# EAGLE design BrimEff (EAGLE 9.5.2)
CNAME: BrimEffect; CREVISION: 01

## Sheet 1 of 3
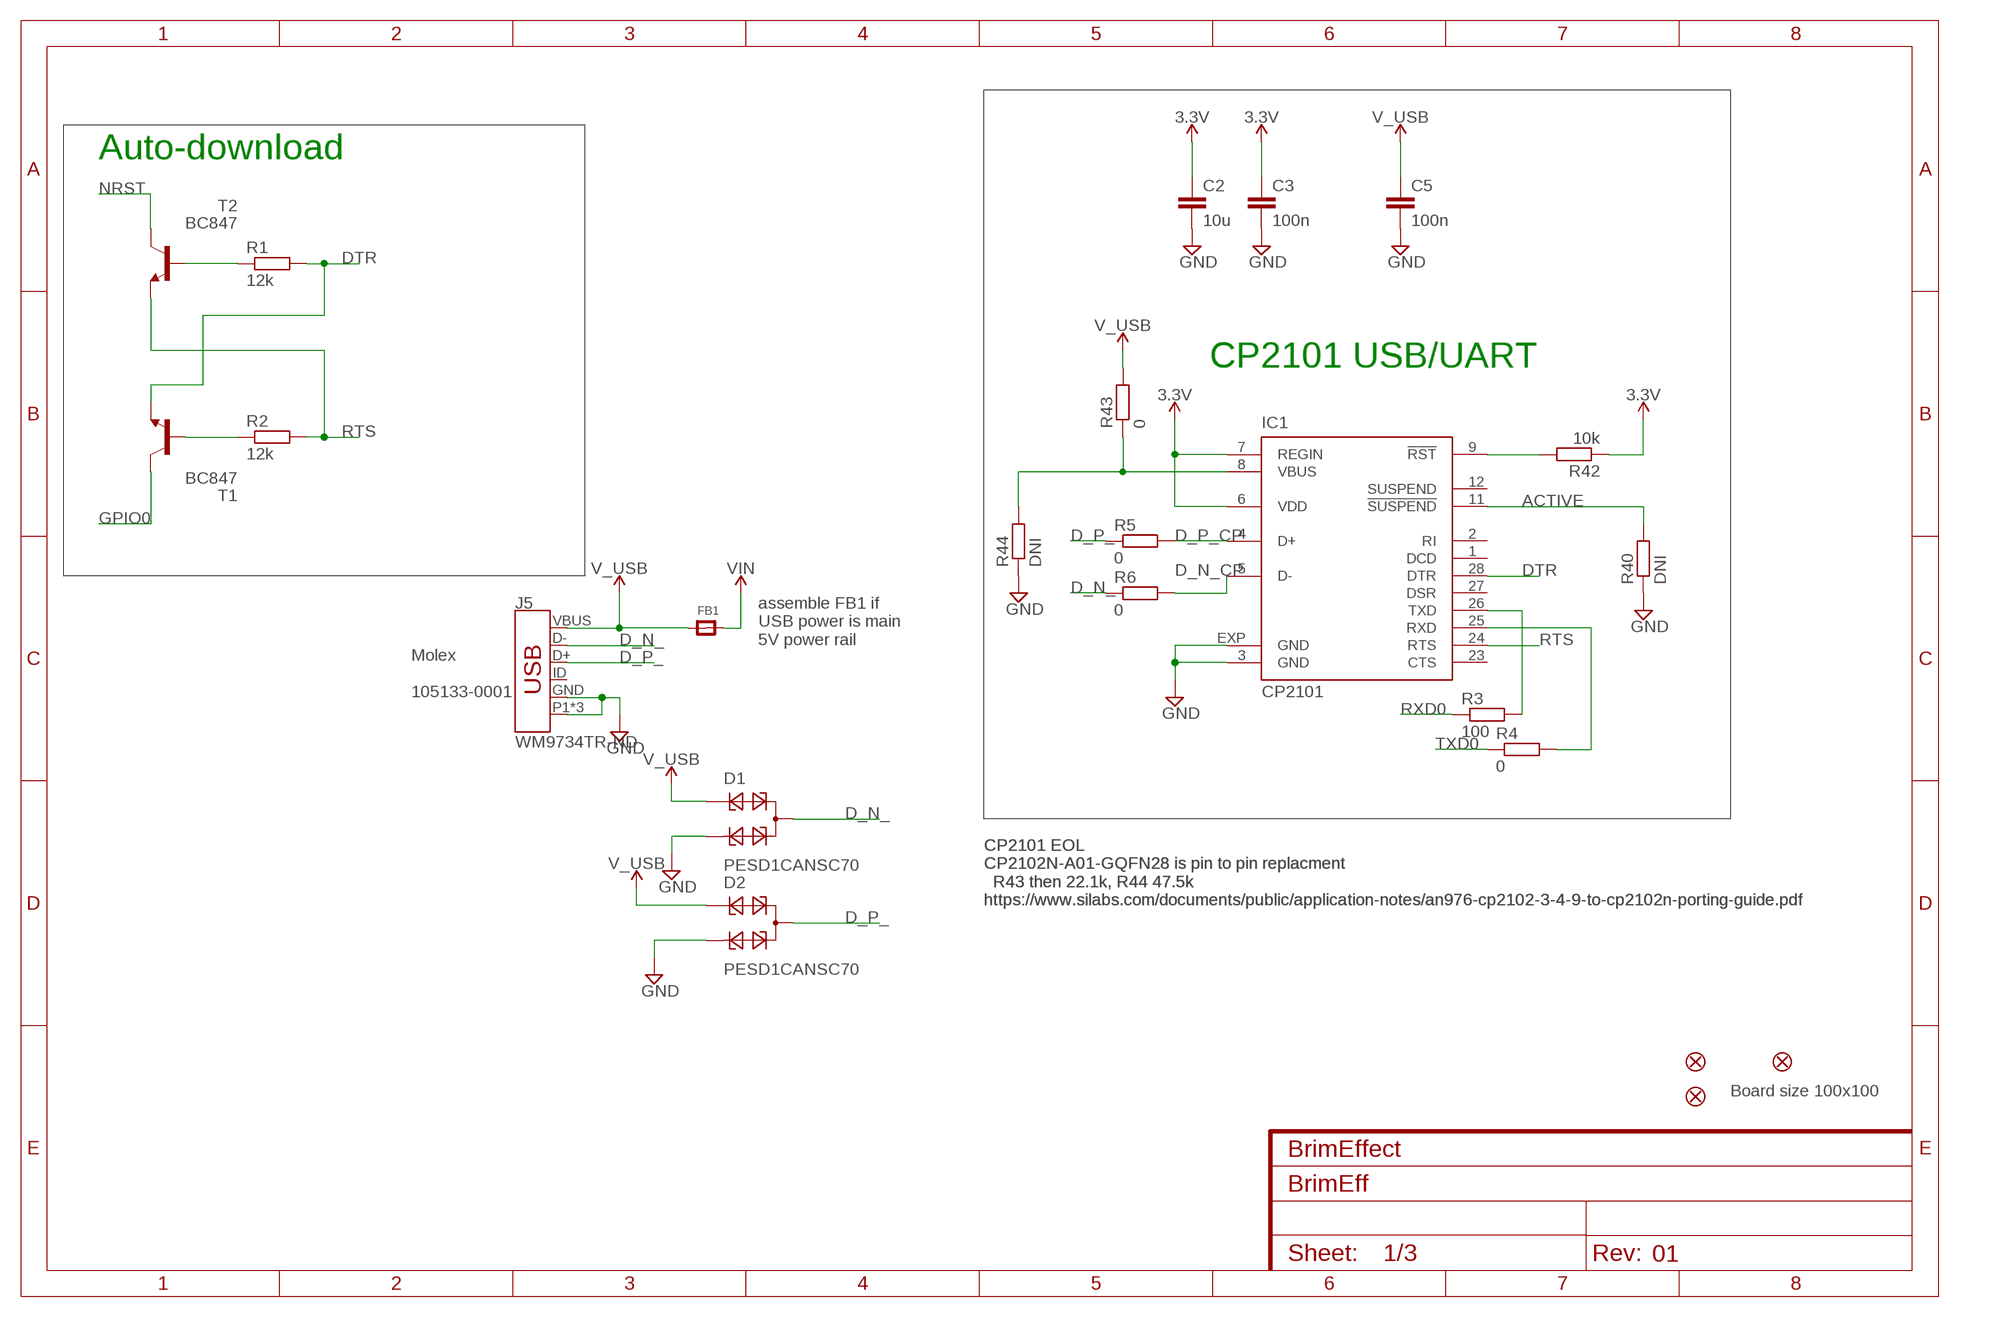
[diagram p0: schematic, sheet 1]

### Parts
C2  10u  C-EUC0603K  [C0603K]
C3  100n  C-EUC0603K  [C0603K]
C5  100n  C-EUC0603K  [C0603K]
D1  PESD1CANSC70  [SOT323-R]
D2  PESD1CANSC70  [SOT323-R]
FB1  FERRITE  [0603]
FID1  FIDUCIAL""  [FIDUCIAL_1MM]
FID2  FIDUCIAL""  [FIDUCIAL_1MM]
FID4  FIDUCIAL""  [FIDUCIAL_1MM]
IC1  CP2101  CP210X_USB_UART  [MLP28]
J5  WM9734TR-ND  USB_MICRO-B_FEMALE-SMT-VERT  [USB-B-MICRO-SMD_VERT]
R1  12k  R-EU_R0603  [R0603]
R2  12k  R-EU_R0603  [R0603]
R3  100  R-EU_R0603  [R0603]
R4  0  R-EU_R0603  [R0603]
R5  0  R-EU_R0603  [R0603]
R6  0  R-EU_R0603  [R0603]
R40  DNI  R-EU_R0603  [R0603]
R42  10k  R-EU_R0603  [R0603]
R43  0  R-EU_R0603  [R0603]
R44  DNI  R-EU_R0603  [R0603]
T1  BC847  [SOT23]
T2  BC847  [SOT23]

### Nets
3.3V: C2.1 C3.1 IC1.6(VDD) IC1.7(REGIN) R42.1 ; also sheet 2,3
ACTIVE: IC1.11(!SUSPEND) R40.2
D_N_: D1.3 J5.D- R6.1
D_N_CP: IC1.5(D-) R6.2
D_P_: D2.3 J5.D+ R5.1
D_P_CP: IC1.4(D+) R5.2
DTR: IC1.28(DTR) R1.2 T1.2(E)
GND: C2.2 C3.2 C5.2 D1.2 D2.2 IC1.3(GND) IC1.EXP(GND) J5.GND J5.P1(SHIELD) J5.P2(SHIELD) J5.P3(SHIELD) R40.1 R44.1 ; also sheet 2,3
GPIO0: T1.3(C) ; also sheet 3
N$1: R1.1 T2.1(B)
N$2: R2.1 T1.1(B)
N$38: IC1.9(!RST) R42.2
N$39: IC1.8(VBUS) R43.1 R44.2
NRST: T2.3(C) ; also sheet 3
RTS: IC1.24(RTS) R2.2 T2.2(E)
RXD0: R3.1 ; also sheet 3
RXD0_CP2101IN: IC1.26(TXD) R3.2
TXD0: R4.1 ; also sheet 3
TXD0_CP2101: IC1.25(RXD) R4.2
V_USB: C5.1 D1.1 D2.1 FB1.1 J5.VBUS R43.2
VIN: FB1.2 ; also sheet 2,3
Unconnected: IC1.1(DCD) IC1.2(RI) IC1.12(SUSPEND) IC1.23(CTS) IC1.27(DSR) J5.ID

### Notes on the sheet
- Auto-download
- CP2101 USB/UART
- assemble FB1 if
  USB power is main
  5V power rail
- Molex
  
  105133-0001
- CP2101 EOL
  CP2102N-A01-GQFN28 is pin to pin replacment
    R43 then 22.1k, R44 47.5k
  https://www.silabs.com/documents/public/application-notes/an976-cp2102-3-4-9-to-cp2102n-porting-guide.pdf
- CP2101 EOL
  CP2102N-A01-GQFN28 is pin to pin replacment
    R43 then 22.1k, R44 47.5k
  https://www.silabs.com/documents/public/application-notes/an976-cp2102-3-4-9-to-cp2102n-porting-guide.pdf
- Board size 100x100

## Sheet 2 of 3
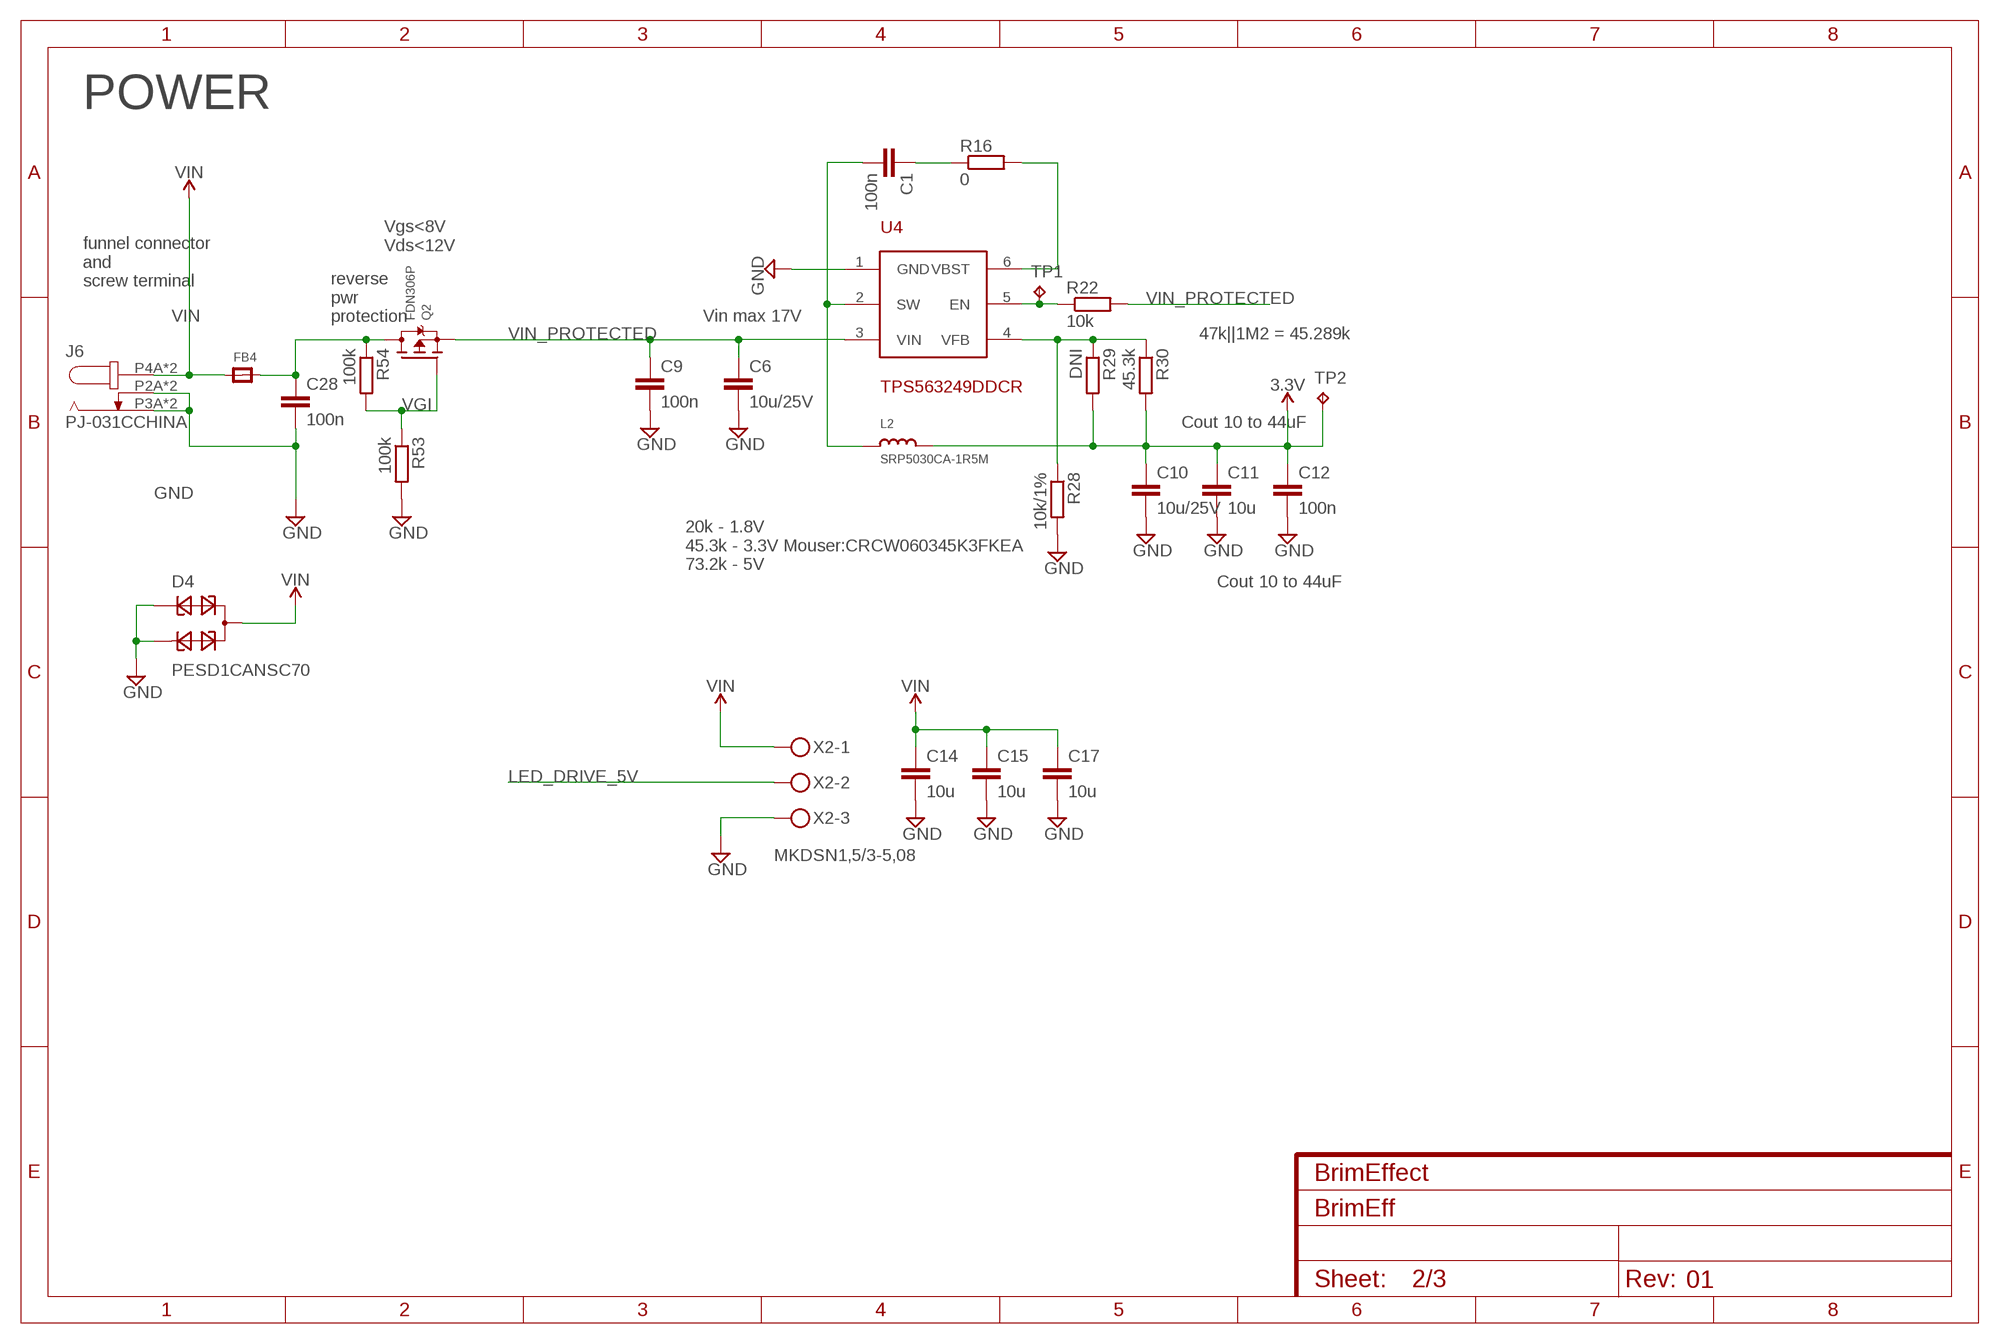
[diagram p1: schematic, sheet 2]

### Parts
C1  100n  C-EUC0603K  [C0603K]
C6  10u/25V  C-EUC0603K  [C0603K]
C9  100n  C-EUC0603K  [C0603K]
C10  10u/25V  C-EUC0603K  [C0603K]
C11  10u  C-EUC0603K  [C0603K]
C12  100n  C-EUC0603K  [C0603K]
C14  10u  C-EUC0603K  [C0603K]
C15  10u  C-EUC0603K  [C0603K]
C17  10u  C-EUC0603K  [C0603K]
C28  100n  C-EUC0603K  [C0603K]
D4  PESD1CANSC70  [SOT323-R]
FB4  FERRITE  [0603]
J6  PJ-031CCHINA  [DC-005_5.5X2.1MM_JACK]
L2  SRP5030CA-1R5M  [SRP5030CA]
Q2  FDN306P  MOSFET-PWIDE  [SOT23-WIDE]
R16  0  R-EU_R0603  [R0603]
R22  10k  R-EU_R0603  [R0603]
R28  10k/1%  R-EU_R0603  [R0603]
R29  DNI  R-EU_R0603  [R0603]
R30  45.3k  R-EU_R0603  [R0603]
R53  100k  R-EU_R0603  [R0603]
R54  100k  R-EU_R0603  [R0603]
TP1  TPTP10R  [TP10R]
TP2  TPTP10R  [TP10R]
U4  TPS563249DDCR  TPS5632149DDCR  [SOT23-6]
X2  MKDSN1,5/3-5,08  [MKDSN1,5/3-5,08]

### Nets
3.3V: C10.1 C11.1 C12.1 L2.P$2 R29.2 R30.2 TP2.TP ; also sheet 1,3
GND: C6.2 C9.2 C10.2 C11.2 C12.2 C14.2 C15.2 C17.2 C28.2 D4.1 D4.2 J6.P2A J6.P2B J6.P3A J6.P3B R28.2 R53.2 U4.1(GND) X2.3 ; also sheet 1,3
LED_DRIVE_5V: X2.2 ; also sheet 3
N$3: C1.1 R16.1
N$4: C28.1 FB4.2 Q2.3(D) R54.1
N$15: R16.2 U4.6(VBST)
N$19: C1.2 L2.P$1 U4.2(SW)
N$23: R22.1 TP1.TP U4.5(EN)
N$24: R28.1 R29.1 R30.1 U4.4(VFB)
VGI: Q2.1(G) R53.1 R54.2
VIN: C14.1 C15.1 C17.1 D4.3 FB4.1 J6.P4A J6.P4B X2.1 ; also sheet 1,3
VIN_PROTECTED: C6.1 C9.1 Q2.2(S) R22.2 U4.3(VIN) ; also sheet 3

### Notes on the sheet
- POWER
- Vgs<8V
  Vds<12V
- funnel connector
  and
  screw terminal
- reverse
  pwr
  protection
- Vin max 17V
- 47k||1M2 = 45.289k
- Cout 10 to 44uF
- 20k - 1.8V
  45.3k - 3.3V Mouser:CRCW060345K3FKEA
  73.2k - 5V
- Cout 10 to 44uF

## Sheet 3 of 3
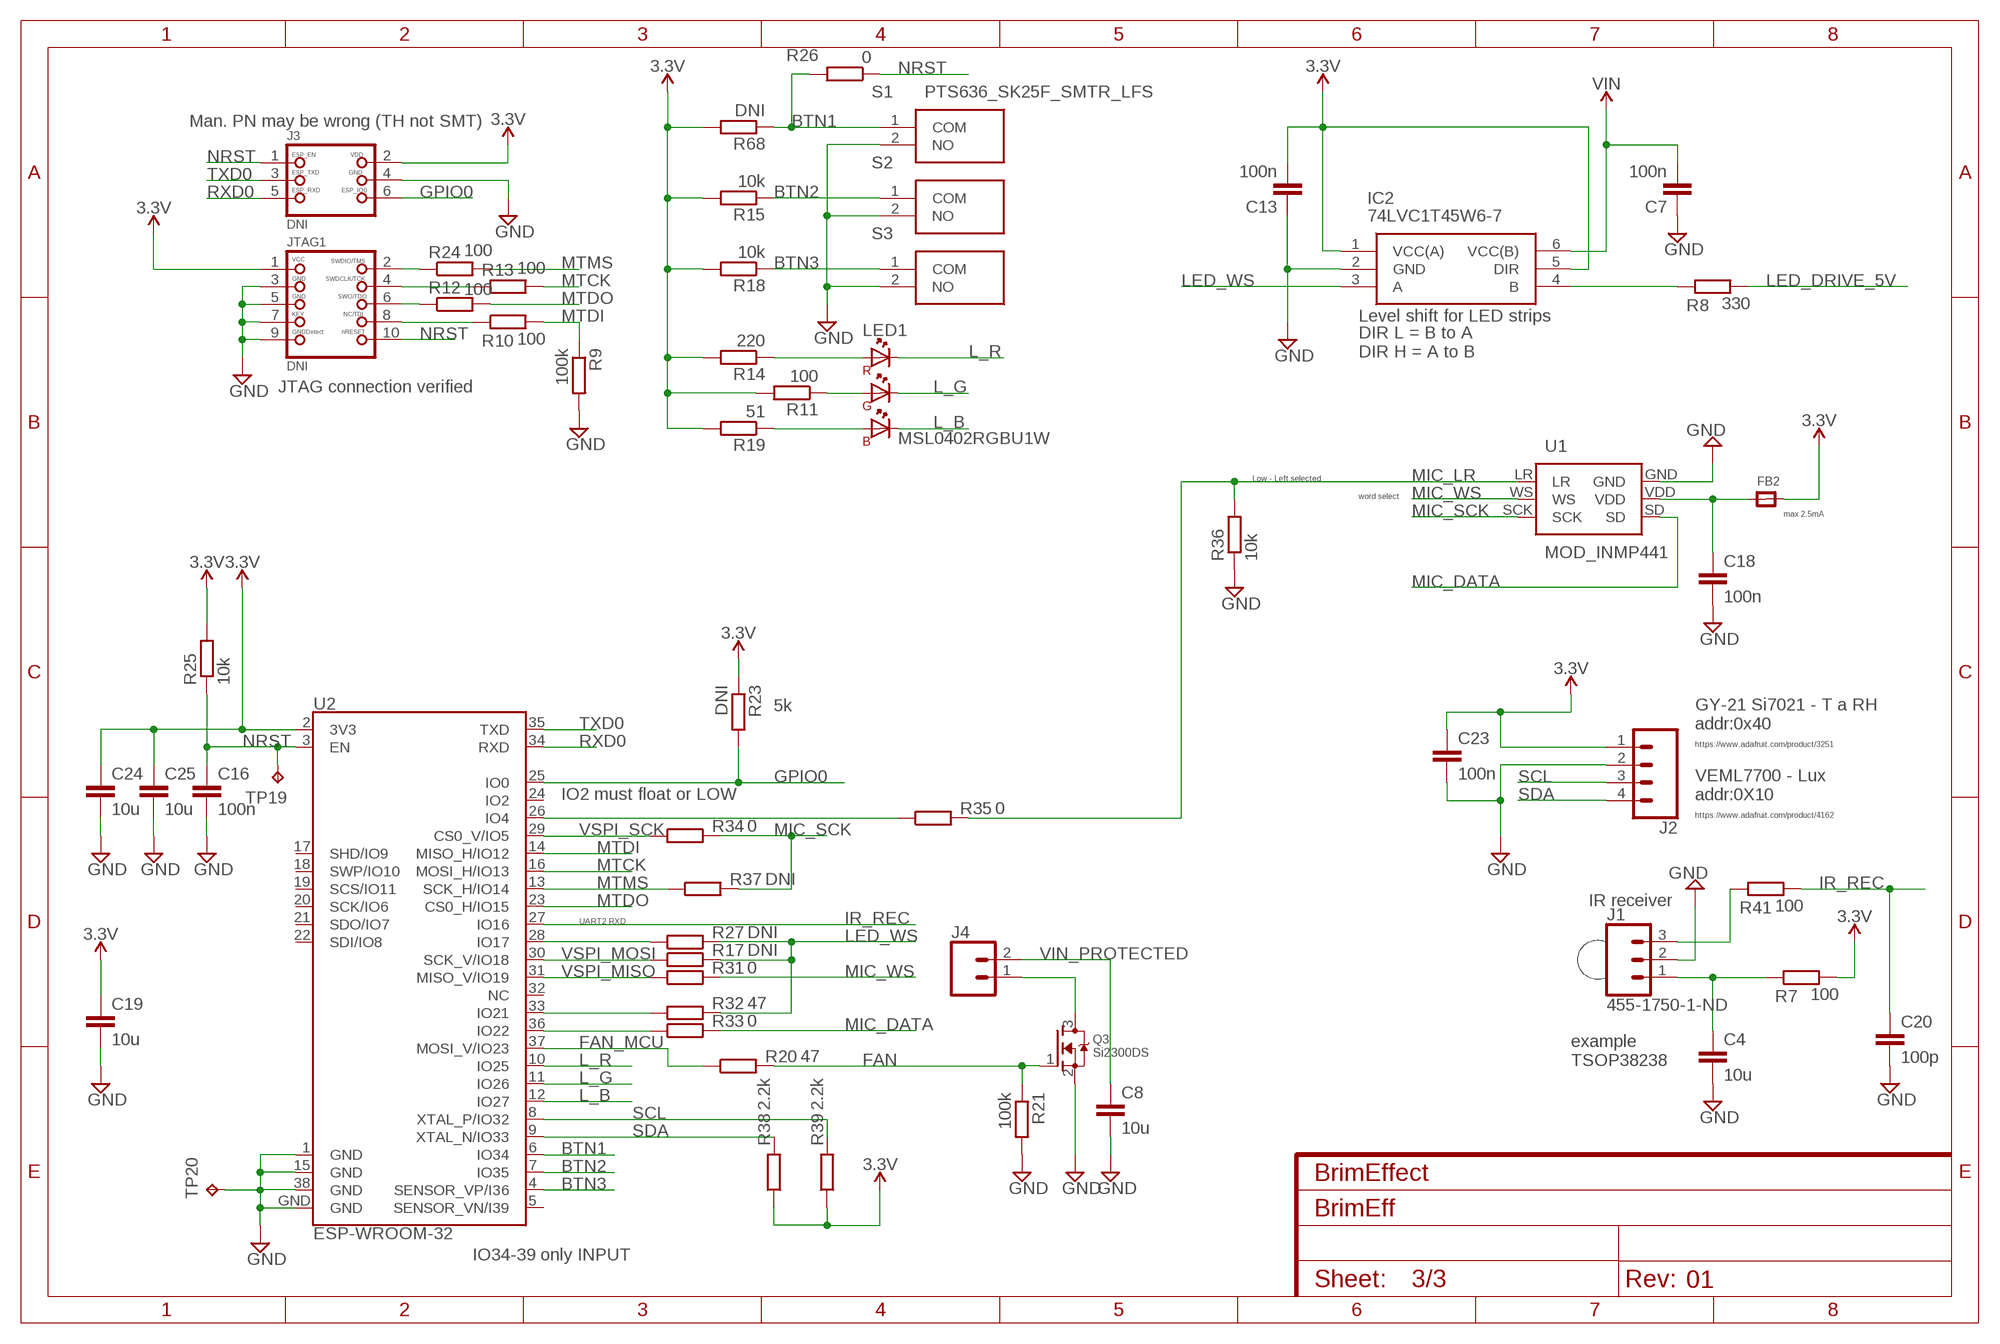
[diagram p2: schematic, sheet 3]

### Parts
C4  10u  C-EUC0603K  [C0603K]
C7  100n  C-EUC0603K  [C0603K]
C8  10u  C-EUC0603K  [C0603K]
C13  100n  C-EUC0603K  [C0603K]
C16  100n  C-EUC0603K  [C0603K]
C18  100n  C-EUC0603K  [C0603K]
C19  10u  C-EUC0603K  [C0603K]
C20  100p  C-EUC0603K  [C0603K]
C23  100n  C-EUC0603K  [C0603K]
C24  10u  C-EUC0603K  [C0603K]
C25  10u  C-EUC0603K  [C0603K]
FB2  FERRITE  [0603]
IC2  74LVC1T45W6-7  [SOT95P285X140-6N]
J1  455-1750-1-ND  CONN_03  [1X03]
J2  CONN_04PTH  [1X04]
J3  DNI  HEADER_3X6P_ESPPROG  [2X03_1.27MM_SMT]
J4  CONN_02  [1X02]
JTAG1  DNI  JTAG-CORTEXM3  [2X05_1.27MM_SMT]
LED1  MSL0402RGBU1W  [MSL0402RGBU1-W]
Q3  Si2300DS  MOSFET-NREFLOW  [SOT23]
R7  100  R-EU_R0603  [R0603]
R8  330  R-EU_R0603  [R0603]
R9  100k  R-EU_R0603  [R0603]
R10  100  R-EU_R0603  [R0603]
R11  100  R-EU_R0603  [R0603]
R12  100  R-EU_R0603  [R0603]
R13  100  R-EU_R0603  [R0603]
R14  220  R-EU_R0603  [R0603]
R15  10k  R-EU_R0603  [R0603]
R17  DNI  R-EU_R0603  [R0603]
R18  10k  R-EU_R0603  [R0603]
R19  51  R-EU_R0603  [R0603]
R20  47  R-EU_R0603  [R0603]
R21  100k  R-EU_R0603  [R0603]
R23  DNI  R-EU_R0603  [R0603]
R24  100  R-EU_R0603  [R0603]
R25  10k  R-EU_R0603  [R0603]
R26  0  R-EU_R0603  [R0603]
R27  DNI  R-EU_R0603  [R0603]
R31  0  R-EU_R0603  [R0603]
R32  47  R-EU_R0603  [R0603]
R33  0  R-EU_R0603  [R0603]
R34  0  R-EU_R0603  [R0603]
R35  0  R-EU_R0603  [R0603]
R36  10k  R-EU_R0603  [R0603]
R37  DNI  R-EU_R0603  [R0603]
R38  2.2k  R-EU_R0603  [R0603]
R39  2.2k  R-EU_R0603  [R0603]
R41  100  R-EU_R0603  [R0603]
R68  DNI  R-EU_R0603  [R0603]
S1  PTS636_SK25F_SMTR_LFS  [PTS636SK25FSMTRLFS]
S2  PTS636_SK25F_SMTR_LFS  [PTS636SK25FSMTRLFS]
S3  PTS636_SK25F_SMTR_LFS  [PTS636SK25FSMTRLFS]
TP19  TPTP10R  [TP10R]
TP20  TPTP10R  [TP10R]
U1  MOD_INMP441  [MOD_INMP441]
U2  ESP-WROOM-32  [ESP-WROOM-32]

### Nets
3.3V: C13.2 C19.1 C23.1 C24.1 C25.1 FB2.2 IC2.1(VCC(A)) IC2.5(DIR) J2.1 J3.2 JTAG1.1 R7.2 R11.2 R14.2 R15.2 R18.2 R19.2 R23.1 R25.2 R38.1 R39.1 R68.2 U2.2(3V3) ; also sheet 1,2
BTN1: R26.2 R68.1 S1.1(COM) U2.6(IO34)
BTN2: R15.1 S2.1(COM) U2.7(IO35)
BTN3: R18.1 S3.1(COM) U2.4(SENSOR_VP/I36)
FAN: Q3.1(G) R20.2 R21.1
FAN_MCU: R20.1 U2.37(MOSI_V/IO23)
GND: C4.2 C7.1 C8.2 C13.1 C16.2 C18.2 C19.2 C20.2 C23.2 C24.2 C25.2 IC2.2(GND) J1.2 J2.2 J3.4 JTAG1.3 JTAG1.5 JTAG1.7 JTAG1.9 Q3.2(S) R9.2 R21.2 R36.1 S1.2(NO) S2.2(NO) S3.2(NO) TP20.TP U1.GND U2.1(GND) U2.15(GND) U2.38(GND) U2.GND ; also sheet 1,2
GPIO0: J3.6 R23.2 U2.25(IO0) ; also sheet 1
IR_REC: C20.1 R41.2 U2.27(IO16)
L_B: LED1.1(K_B) U2.12(IO27)
L_G: LED1.2(K_G) U2.11(IO26)
L_R: LED1.3(K_R) U2.10(IO25)
LED_DRIVE_5V: R8.2 ; also sheet 2
LED_WS: IC2.3(A) R17.2 R27.2 R32.2
MIC_DATA: R33.2 U1.SD
MIC_LR: R35.2 R36.2 U1.LR
MIC_SCK: R34.2 R37.2 U1.SCK
MIC_WS: R31.2 U1.WS
MTCK: R13.2 U2.16(MOSI_H/IO13)
MTDI: R9.1 R10.2 U2.14(MISO_H/IO12)
MTDO: R12.2 U2.23(CS0_H/IO15)
MTMS: R24.2 R37.1 U2.13(SCK_H/IO14)
N$5: J1.3 R41.1
N$6: LED1.6(A_B) R19.1
N$8: J4.1 Q3.3(D)
N$9: C4.1 J1.1 R7.1
N$10: IC2.4(B) R8.1
N$11: LED1.5(A_G) R11.1
N$12: C18.1 FB2.1 U1.VDD
N$13: R27.1 U2.28(IO17)
N$14: R32.1 U2.33(IO21)
N$16: LED1.4(A_R) R14.1
N$17: R33.1 U2.36(IO22)
N$20: R35.1 U2.26(IO4)
NRST: C16.1 J3.1 JTAG1.10 R25.1 R26.1 TP19.TP U2.3(EN) ; also sheet 1
RXD0: J3.5 U2.34(RXD) ; also sheet 1
SCL: J2.3 R39.2 U2.8(XTAL_P/IO32)
SDA: J2.4 R38.2 U2.9(XTAL_N/IO33)
TCKCONN: JTAG1.4 R13.1
TDICONN: JTAG1.8 R10.1
TDOCONN: JTAG1.6 R12.1
TMSCONN: JTAG1.2 R24.1
TXD0: J3.3 U2.35(TXD) ; also sheet 1
VIN: C7.2 IC2.6(VCC(B)) ; also sheet 1,2
VIN_PROTECTED: C8.1 J4.2 ; also sheet 2
VSPI_MISO: R31.1 U2.31(MISO_V/IO19)
VSPI_MOSI: R17.1 U2.30(SCK_V/IO18)
VSPI_SCK: R34.1 U2.29(CS0_V/IO5)
Unconnected: U2.5(SENSOR_VN/I39) U2.17(SHD/IO9) U2.18(SWP/IO10) U2.19(SCS/IO11) U2.20(SCK/IO6) U2.21(SDO/IO7) U2.22(SDI/IO8) U2.24(IO2) U2.32(NC)

### Notes on the sheet
- Man. PN may be wrong (TH not SMT)
- Level shift for LED strips
- DIR L = B to A
  DIR H = A to B
- JTAG connection verified
- Low - Left selected
- word select
- max 2.5mA
- 5k
- GY-21 Si7021 - T a RH 
  addr:0x40
- https://www.adafruit.com/product/3251
- IO2 must float or LOW
- VEML7700 - Lux
  addr:0X10
- https://www.adafruit.com/product/4162
- IR receiver
- UART2 RXD
- example
  TSOP38238
- IO34-39 only INPUT

## Library data of the parts
C1 C3 C5 C7 C9 C12 C13 C16 C18 C23 C28 = resistor:C-EU: CAPACITOR, European symbol; PARTNO: CC0603KRX7R8BB104
C2 C4 C8 C11 C14 C15 C17 C19 C20 C24 C25 = resistor:C-EU: CAPACITOR, European symbol; PARTNO: GRM188R61A106KE69J
C6 C10 = resistor:C-EU: CAPACITOR, European symbol; PARTNO: GRM188R61E106KA73J
D1 D2 D4 = diode:PESD1CAN: CAN bus ESD protection diode Source: http://www.nxp.com/documents/data_sheet/PESD1CAN.pdf; PARTNO: PESD1CAN-UX
FB1 FB2 FB4 = microbuilder:FERRITE: Ferrite Bead 0603 MMZ1608B121C - 120 Ohm @ 100MHz, 600mA, 0.15 Ohm DC Resistance - Digikey: 445-2164-1-ND BK1608HW121-T - 120 Ohm, 600mA Ferrite Chip - Digikey: 587-1876-2-ND 0805 HZ0805B272R-10 - 2.7K Ohm @ 100MHz, 200mA, 0.8 Ohm DC Resistance - Digikey: 240-2504-1-ND (see also Murata BLM21BD272SN1L) MMZ2012Y152B - 1.5K Ohm @ 100MHz, 500mA, 0.4 Ohm DC Resistance - Digikey: 445-1560-1-ND - Mainly for high frequency (80-400MHz) MMZ2012R102A - 1K Ohm @ 100MHz, 500mA, 0.3 Ohm DC Resistance - Digikey: 445-1555-2-ND - More general purpose (10-200MHz); PARTNO: BLM18PG121SN1D
FID1 FID2 FID4 = microbuilder:FIDUCIAL: Fiducial Alignment Points Various fiducial points for machine vision alignment.
IC1 = SparkFun-Retired:CP210X_USB_UART: Single-Chip USB to UART Bridge Source: www.silabs.com .. CP2101.pdf / cp2102.pdf. Spark Fun Electronics SKU : COM-00310 RETIRED: IC-00865; PARTNO: CP2101-GM; PROD_ID: COM-00310
IC2 = SamacSys_Parts:74LVC1T45W6-7: Translation - Voltage Levels Logic LVC 1G Translator Source: Datasheet <https://componentsearchengine.com/Datasheets/1/74LVC1T45W6-7.pdf>; DESCRIPTION: Translation - Voltage Levels Logic LVC 1G Translator; HEIGHT: 1.4mm; MANUFACTURER_NAME: Diodes Inc.; MANUFACTURER_PART_NUMBER: 74LVC1T45W6-7; MOUSER_PART_NUMBER: 621-74LVC1T45W6-7; MOUSER_PRICE-STOCK: https://www.mouser.com/Search/Refine.aspx?Keyword=621-74LVC1T45W6-7
J1 = SparkFun-Connectors:CONN_03: Multi connection point. Often used as Generic Header-pin footprint for 0.1 inch spaced/style header connections On any of the 0.1 inch spaced packages, you can populate with these: Break Away Headers - Straight <https://www.sparkfun.com/products/116> (PRT-00116) Break Away Male Headers - Right Angle <https://www.sparkfun.com/products/553> (PRT-00553) Female Headers <https://www.sparkfun.com/products/115> (PRT-00115) Break Away Headers - Machine Pin <https://www.sparkfun.com/products/117> (PRT-00117) Break Away Female Headers - Swiss Machine Pin <https://www.sparkfun.com/products/743> (PRT-00743) Stackable Header - 3 Pin (Female, 0.1") <https://www.sparkfun.com/products/13875> (PRT-13875) For SCREWTERMINALS and SPRING TERMINALS visit here: Screw Terimnals on SparkFun.com <https://www.sparkfun.com/search/results?term=Screw+Terminals> (5mm/3.5mm/2.54mm spacing) This device is also useful as a general connection point to wire up your design to another part of your project. Our various solder wires solder well into these plated through hole pads. Hook-Up Wire - Assortment (Stranded, 22 AWG) <https://www.sparkfun.com/products/11375> (PRT-11375) Hook-Up Wire - Assortment (Solid Core, 22 AWG) <https://www.sparkfun.com/products/11367> (PRT-11367) View the entire wire category on our website here <https://www.sparkfun.com/categories/141> Special notes: Molex polarized connector foot print use with SKU : PRT-08232 with associated crimp pins and housings.; PROD_ID: XXX-00000
J2 = SparkFun-Connectors:CONN_04: Multi connection point. Often used as Generic Header-pin footprint for 0.1 inch spaced/style header connections On any of the 0.1 inch spaced packages, you can populate with these: Break Away Headers - Straight <https://www.sparkfun.com/products/116> (PRT-00116) Break Away Male Headers - Right Angle <https://www.sparkfun.com/products/553> (PRT-00553) Female Headers <https://www.sparkfun.com/products/115> (PRT-00115) Break Away Headers - Machine Pin <https://www.sparkfun.com/products/117> (PRT-00117) Break Away Female Headers - Swiss Machine Pin <https://www.sparkfun.com/products/743> (PRT-00743) For SCREWTERMINALS and SPRING TERMINALS visit here: Screw Terimnals on SparkFun.com <https://www.sparkfun.com/search/results?term=Screw+Terminals> (5mm/3.5mm/2.54mm spacing) This device is also useful as a general connection point to wire up your design to another part of your project. Our various solder wires solder well into these plated through hole pads. Hook-Up Wire - Assortment (Stranded, 22 AWG) <https://www.sparkfun.com/products/11375> (PRT-11375) Hook-Up Wire - Assortment (Solid Core, 22 AWG) <https://www.sparkfun.com/products/11367> (PRT-11367) View the entire wire category on our website here <https://www.sparkfun.com/categories/141> Special notes: Molex polarized connector foot print use with SKU : PRT-08231 with associated crimp pins and housings. 1MM SMD Version SKU: PRT-10208; PROD_ID: CONN-09696
J3 = FRA_eagle_lib:HEADER_3X6P_ESPPROG; PARTNO: HTMS-103-03-T-D-SM
J4 = SparkFun-Connectors:CONN_02: Multi connection point. Often used as Generic Header-pin footprint for 0.1 inch spaced/style header connections On any of the 0.1 inch spaced packages, you can populate with these: Break Away Headers - Straight <https://www.sparkfun.com/products/116> (PRT-00116) Break Away Male Headers - Right Angle <https://www.sparkfun.com/products/553> (PRT-00553) Female Headers <https://www.sparkfun.com/products/115> (PRT-00115) Break Away Headers - Machine Pin <https://www.sparkfun.com/products/117> (PRT-00117) Break Away Female Headers - Swiss Machine Pin <https://www.sparkfun.com/products/743> (PRT-00743) For SCREWTERMINALS and SPRING TERMINALS visit here: Screw Terimnals on SparkFun.com <https://www.sparkfun.com/search/results?term=Screw+Terminals> (5mm/3.5mm/2.54mm spacing) This device is also useful as a general connection point to wire up your design to another part of your project. Our various solder wires solder well into these plated through hole pads. Hook-Up Wire - Assortment (Stranded, 22 AWG) <https://www.sparkfun.com/products/11375> (PRT-11375) Hook-Up Wire - Assortment (Solid Core, 22 AWG) <https://www.sparkfun.com/products/11367> (PRT-11367) View the entire wire category on our website here <https://www.sparkfun.com/categories/141> Special notes: Molex polarized connector foot print use with: PRT-08233 with associated crimp pins and housings. 2.54_SCREWTERM for use with PRT-10571. 3.5mm Screw Terminal footprints for PRT-08084 5mm Screw Terminal footprints for use with PRT-08432
J5 = SparkFun-Connectors:USB_MICRO-B: USB Type Micro-B Connector Male/female and PTH/SMT variants SparkFun Products: SparkFun microB USB Breakout <https://www.sparkfun.com/products/12035> SparkFun USB microB Plug Breakout <https://www.sparkfun.com/products/10031> SparkFun ESP8266 Thing <https://www.sparkfun.com/products/13231>; PARTNO: 105133-0001; PROD_ID: CONN-13534
J6 = SamacSys_Parts:PJ-031C: DC Power Connectors Power Jacks Source: Datasheet <https://componentsearchengine.com/Datasheets/1/PJ-031C.pdf>
JTAG1 = microbuilder:JTAG-CORTEXM3: Serial Wire (SW-DP) Connector This standard 0.05" 10-pin connector is for use with the Cortex M0/M3's native SWD (serial wire debugger) interface (SW-DP). Some boards support a 20-pin combined JTAG+SWD connector (SWJ-DP), such as the LPC1700 family, but many smaller devices only work with SWD which typically use the smaller 10-pin SW-DP connecter (the LPC1300 family, for example, only supports SWD). 2x05 1.27mm/0.05" Connector: This is the standard SMT connector defined by ARM for all Cortex devices, and should be used in most situations and for forward-compatibility since any new devices coming to market will likely use this connector. MOLEX 10 Pin 0.1" Connector: This 0.1" 10 pin connector has the same pin layout as the standard 0.05" connector, but is easier to work with if you are using standard jumper wires or custom cables to connect your SWD hardware. MOLEX 20 Pin 0.1" Connector: This 0.1" 20 pin connector is the same model used for ARM7/ARM9 JTAG debuggers, but is connected to match the pins on the Segger J-Link for ARM (which supports both JTAG and SWD debugging). See the following document from ARM for more information on Cortex M3 Debug Connectors: http://infocenter.arm.com/help/topic/com.arm.doc.faqs/attached/13634/cortex_debug_connectors.pdf And the following page for an overview with images of the different connector types: http://www.keil.com/peripherals/coresight/connectors.asp; PARTNO: M50-3600542R
L2 = FRA_eagle_lib:SRP5030CA-1R5M: https://www.bourns.com/docs/Product-Datasheets/SRP5030CA.pdf https://www.mouser.com/ProductDetail/Bourns/SRP5030CA-1R5M?qs=%2Fha2pyFadui7REpqWHuidBV20ENgXdYStxO18hOBLFz1Bpqagkv5Sg%3D%3D; PARTNO: SRP5030CA-1R5M
LED1 = SamacSys_Parts:MSL0402RGBU1: High Brightness RGB LED SMT 1816(0706) Source: Datasheet <https://componentsearchengine.com/Datasheets/1/MSL0402RGBU1.pdf>
Q2 = microbuilder:MOSFET-P: P-Channel Mosfet LEGEND VDS: Voltage Drain-Source ID: Drain Current RDS(ON): Drain-Source On-State Resistance VGS(TH): Gate-Source Threshold Voltage CISS: Drain-Source Input Capacitance SOT-23 Name VDS ID RDS(ON) VGS(TH) CISS Order Number IRLML5103 30V 760mA 600 mOhm -- 75pF @ 25V Digikey: IRLML5103PBFCT-ND IRLML6401 12V 4.3A 50 mOhm 950mV @ 250µA 830pF @ 10V Digikey: IRLML6401PBFTR-ND NTR0202PL 20V 400mA 800 mOhm 2.3V @ 250uA 70pF @ 5V Digikey: NTR0202PLT1GOSTR-ND NTR4101PT1G 20V 1.8A 85 mOhm 1.2V @ 250uA 675pF @ 10V Digikey: NTR4101PT1GOSCT-ND DMP2004K 20V 600mA 900 mOhm 1V @ 250uA 175pF @ 16V Digikey: DMP2004KDICT-ND PMV65XP 20V 3.9A 76 mOhm 950mV @ 1mA 725pF @ 20V Digikey: 568-2358-2-ND TO-252 Name VDS ID RDS(ON) VGS(TH) CISS Order Number AOD417 30V 25A 34 mOhm 3V @ 250µA 920pF @ 15V Digikey: 785-1106-2-ND; PARTNO: FDN306P
Q3 = adafruit:MOSFET-N: N-Channel Mosfet 2N7002E - 60V 260mA SOT23 [Digikey: 2N7002ET1GOSTR-ND] - REEL BSH103 - 30V 850mA SOT23 [Digikey: 568-5013-1-ND]; PARTNO: SI2300DS-T1-GE3
R1 R2 = resistor:R-EU_: RESISTOR, European symbol; PARTNO: RC0603FR-0712KL
R3 R7 R8 R10-R14 R19 R24 R41 = resistor:R-EU_: RESISTOR, European symbol; PARTNO: CRCW0603100RFKEAC
R4-R6 R16 R23 R40 R43 R44 = resistor:R-EU_: RESISTOR, European symbol; PARTNO: CRCW06030000Z0EAC
R9 R21 R53 R54 = resistor:R-EU_: RESISTOR, European symbol; PARTNO: CRCW0603100KFKEAC
R15 R18 R22 R25 R26 R36 R42 R68 = resistor:R-EU_: RESISTOR, European symbol; PARTNO: CRCW060310K0JNEAC
R17 R20 R27 R31-R35 R37-R39 = resistor:R-EU_: RESISTOR, European symbol; PARTNO: CRCW060347R0FKEAC
R28 = resistor:R-EU_: RESISTOR, European symbol; PARTNO: RN73R1JTTD1002D25
R29 = resistor:R-EU_: RESISTOR, European symbol
R30 = resistor:R-EU_: RESISTOR, European symbol; PARTNO: ERJ-PB3D4532V
S1-S3 = SamacSys_Parts:PTS636_SK25F_SMTR_LFS: Tactile Switches Tact 50mA 12VDC, 6.0x3.5, 2.5mm H, 250gf, F leads, No ground pin, Red Actuator Source: Datasheet <https://componentsearchengine.com/Datasheets/1/PTS636 SK25F SMTR LFS.pdf>; DESCRIPTION: Tactile Switches Tact 50mA 12VDC, 6.0x3.5, 2.5mm H, 250gf, F leads, No ground pin, Red Actuator; HEIGHT: 2.7mm; MANUFACTURER_NAME: C & K COMPONENTS; MANUFACTURER_PART_NUMBER: PTS636 SK25F SMTR LFS; MOUSER_PART_NUMBER: 611-PTS636SK25FSMTRL; MOUSER_PRICE-STOCK: https://www.mouser.com/Search/Refine.aspx?Keyword=611-PTS636SK25FSMTRL
T1 T2 = transistor-neu-to92:BC847: NPN TRANSISTOR; PARTNO: BC847A-TP
TP1 TP2 TP19 TP20 = testpad:TP: Test pad
U1 = Mic_module_INMP441:MOD_INMP441
U2 = SparkFun-RF:ESP-WROOM-32; PARTNO: ESP32-WROOM-32; PROD_ID: IC-13849
U4 = FRA_eagle_lib:TPS5632149DDCR: TPS563249 17-V, 3-A, Constant 1.4-MHz Synchronous Step-Down Voltage Regulator datasheet <http://www.ti.com/lit/ds/symlink/tps563249.pdf> • Input Voltage Range: 4.5 V to 17 V • Output Voltage Range: 0.6 V to 7 V The TPS563249 is a simple, easy-to-use, 3 A synchronous step-down converter in SOT-23 package. The device is optimized to operate with minimum external component counts and also optimized to achieve low standby current. This switching regulator employs D-CAP3 mode control providing a fast transient response and supporting both low-equivalent series resistance (ESR) output capacitors such as specialty polymer and ultra-low ESR ceramic capacitors with no external compensation components. TPS563249 operates in Forced Continuous Conduction Mode (FCCM), which maintains fixed 1.4 MHz switching frequency during light load operation and eliminates system interference. The TPS563249 is available in a 6-pin 1.6-mm × 2.9-mm SOT (DDC) package, and specified from a –40°C to 125°C junction temperature.; PARTNO: TPS563249DDCR
X2 = con-phoenix-508:MKDSN1,5/3-5,08: MKDSN 1,5/ 3-5,08 Printklemme Nennstrom: 13,5 A Nennspannung: 250 V Rastermaß: 5,08 mm Polzahl: 3 Anschlussart: Schraubanschluss Montage: Löten Anschlussrichtung Leiter/Platine: 0 ° Artikelnummer: 1729131 Source: http://eshop.phoenixcontact.com .. 1729131.pdf

## Board
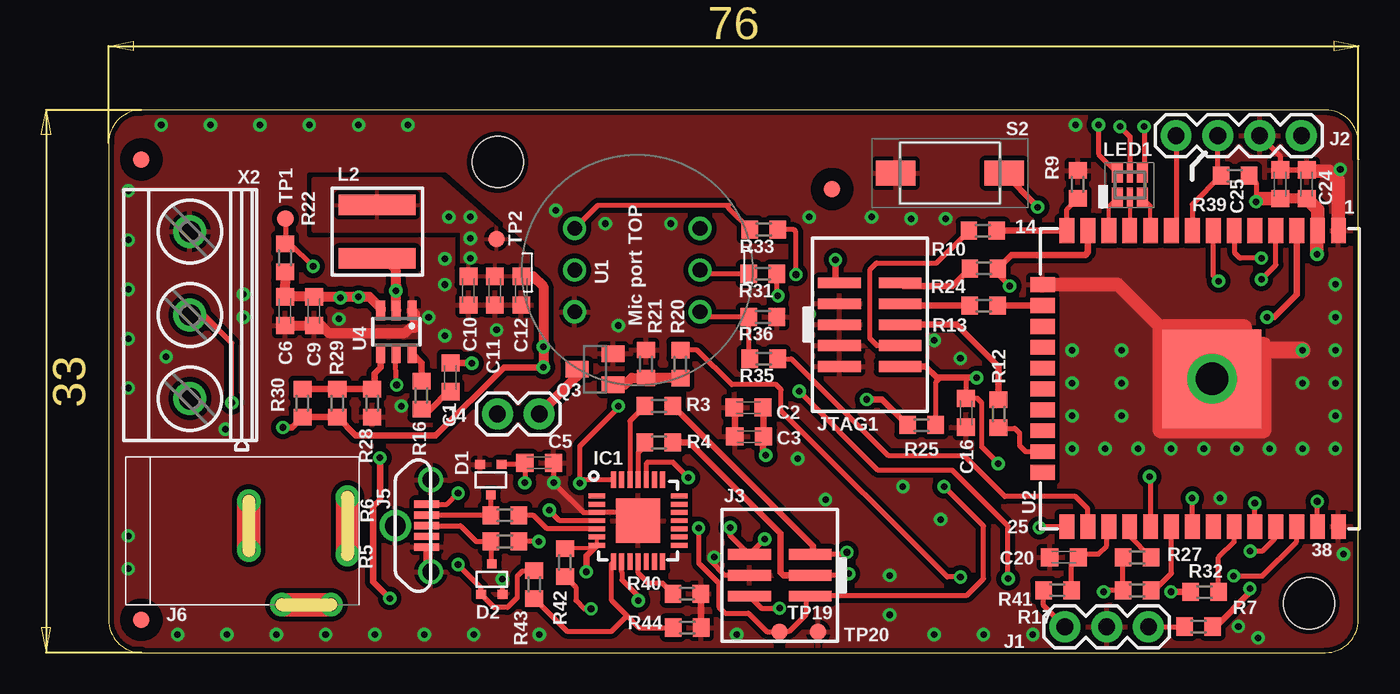
[diagram p3: board, top side]
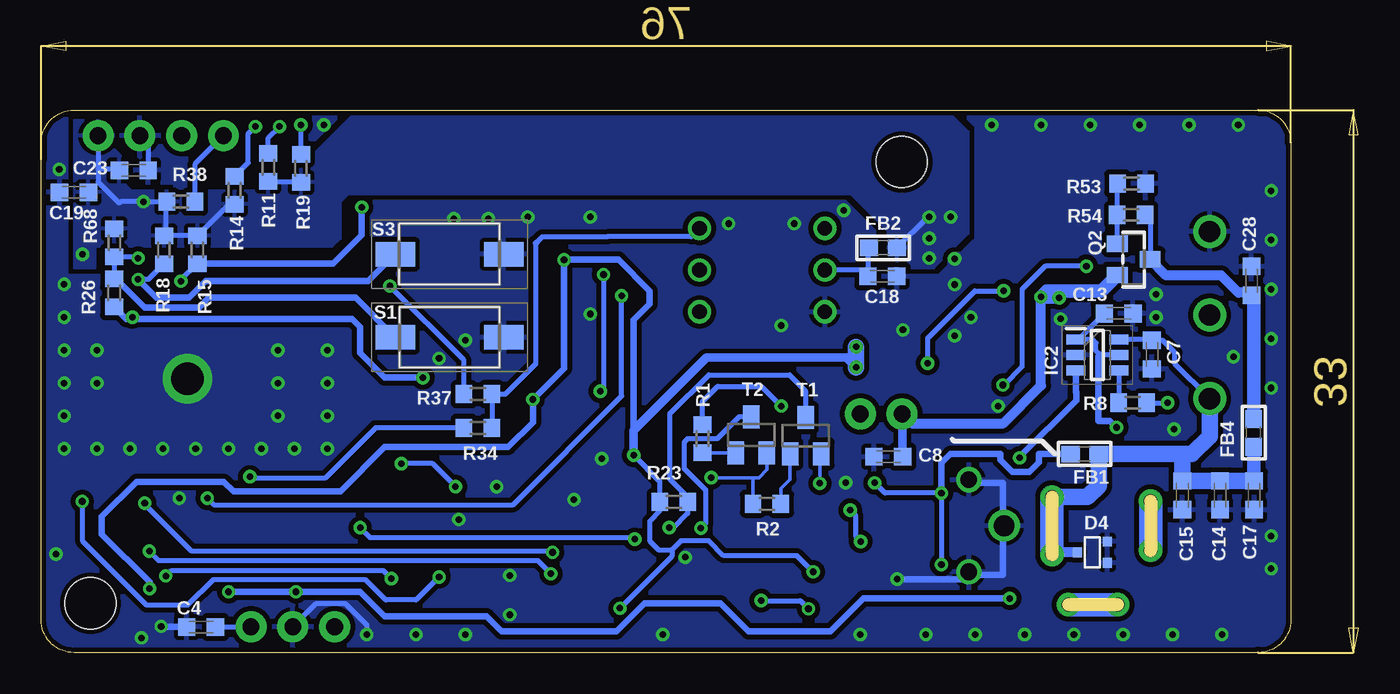
[diagram p4: board, bottom side, seen from below]

Size 76 x 33 mm. Coordinates in mm from the lower left corner, seen from the top.
Outline: 0,31 0,2 arc90 2,0 74,0 arc90 76,2 76,31 arc90 74,33 2,33 arc90 0,31
Copper layers (1*16): Top 0.035mm / dielectric 1.6mm / Bottom 0.035mm
Design rules "AllPCB": minimum track width 6mil, minimum drill 0.399mm, track to track 0.149859375mm, track to pad 0.149859375mm, pad to pad 8mil, via to via 17mil, smd to smd 6mil, copper to edge 10mil, drill to drill 24mil, minimum pad ring 10mil, minimum via ring 8mil, stop-mask expansion 4mil, vias tented up to drill 0.3mm, thermal gap 10mil
Holes 3.1 mm at 73,3 23.66,29.84
tKeepout: area 70.8,0.8 to 75.2,5.2; area 21.4,27.6 to 25.9,32.1

### Footprints (pad centres in the part's own frame; a part is rotated, then mirrored left to right if it is on the bottom)
C0603K = smd 1.05 x 1.08: 1 -0.875,0; 2 0.875,0
SOT323-R = smd 0.6 x 0.55: 1 -0.65,-0.925; 2 0.65,-0.925; 3 0,0.925
0603 = smd 1.1 x 1: 1 -0.85,0; 2 0.85,0
FIDUCIAL_1MM = smd 1 x 1: 1 0,0
MLP28 = smd 1 x 0.3: 1 -2.5,1.5; 2 -2.5,1; 3 -2.5,0.5; 4 -2.5,0; 5 -2.5,-0.5; 6 -2.5,-1; 7 -2.5,-1.5; 15 2.5,-1.5; 16 2.5,-1; 17 2.5,-0.5; 18 2.5,0; 19 2.5,0.5; 20 2.5,1; 21 2.5,1.5 | smd 0.3 x 1: 8 -1.5,-2.5; 9 -1,-2.5; 10 -0.5,-2.5; 11 0,-2.5; 12 0.5,-2.5; 13 1,-2.5; 14 1.5,-2.5; 22 1.5,2.5; 23 1,2.5; 24 0.5,2.5; 25 0,2.5; 26 -0.5,2.5; 27 -1,2.5; 28 -1.5,2.5 | smd 2.7 x 2.7: EXP 0,0
SOT95P285X140-6N = smd 1.15 x 0.6: 1 -1.3,0.95; 2 -1.3,0; 3 -1.3,-0.95; 4 1.3,-0.95; 5 1.3,0; 6 1.3,0.95
1X03 = drill 1.016 pad 1.88: 1 0,0; 2 2.54,0; 3 5.08,0
1X04 = drill 1.016 pad 1.88: 1 0,0; 2 2.54,0; 3 5.08,0; 4 7.62,0
2X03_1.27MM_SMT = smd 0.65 x 2.6: 1 -1.27,-1.85; 2 -1.27,1.85; 3 0,-1.85; 4 0,1.85; 5 1.27,-1.85; 6 1.27,1.85
1X02 = drill 1.016 pad 1.88: 1 0,0; 2 2.54,0
USB-B-MICRO-SMD_VERT = smd 0.45 x 1.5: D+ 0,0; D- -0.65,0; GND 1.3,0; ID 0.65,0; VBUS -1.3,0 | drill 1.016: P1 -2.8,0.25; P2 2.8,0.25 | drill 1.27: P3 0,-1.9
DC-005_5.5X2.1MM_JACK = drill 0.8 pad 1.422: P2A 9.5,0; P2B 12.5,0; P3A 7.5,6.3; P3B 7.5,3.3; P4A 13.5,6.55; P4B 13.5,3.05
2X05_1.27MM_SMT = smd 0.65 x 2.6: 1 -2.54,-1.85; 2 -2.54,1.85; 3 -1.27,-1.85; 4 -1.27,1.85; 5 0,-1.85; 6 0,1.85; 7 1.27,-1.85; 8 1.27,1.85; 9 2.54,-1.85; 10 2.54,1.85
SRP5030CA = smd 1.25 x 4.7: P$1 -1.625,0; P$2 1.625,0
MSL0402RGBU1-W = smd 0.67 x 1.2: 1 0.32,0.76; 3 -1.22,0.76; 4 -1.22,-0.76; 6 0.32,-0.76 | smd 0.37 x 1.2: 2 -0.45,0.76; 5 -0.45,-0.76
SOT23-WIDE = smd 1 x 1.27: 1 -0.95,-1; 2 0.95,-1; 3 0,1
SOT23 = smd 1 x 1.4: 1 -0.95,-1.1; 2 0.95,-1.1; 3 0,1.1
R0603 = smd 1 x 1.1: 1 -0.85,0; 2 0.85,0
PTS636SK25FSMTRLFS = smd 2.4 x 1.5: 1 -3.3,0; 2 3.3,0
TP10R = smd 1 x 1: TP 0,0
MOD_INMP441 = drill 0.9: GND -2.54,3.81; LR -2.54,-3.81; SCK 2.54,-3.81; SD 2.54,3.81; VDD 0,3.81; WS 0,-3.81
ESP-WROOM-32 = smd 0.9 x 1.5: 1 7.7,9; 2 6.43,9; 3 5.16,9; 4 3.89,9; 5 2.62,9; 6 1.35,9; 7 0.08,9; 8 -1.19,9; 9 -2.46,9; 10 -3.73,9; 11 -5,9; 12 -6.27,9; 13 -7.54,9; 14 -8.81,9; 25 -8.81,-9; 26 -7.54,-9; 27 -6.27,-9; 28 -5,-9; 29 -3.73,-9; 30 -2.46,-9; 31 -1.19,-9; 32 0.08,-9; 33 1.35,-9; 34 2.62,-9; 35 3.89,-9; 36 5.16,-9; 37 6.43,-9; 38 7.7,-9 | smd 1.5 x 0.9: 15 -10.3,5.715; 16 -10.3,4.445; 17 -10.3,3.175; 18 -10.3,1.905; 19 -10.3,0.635; 20 -10.3,-0.635; 21 -10.3,-1.905; 22 -10.3,-3.175; 23 -10.3,-4.445; 24 -10.3,-5.715 | smd 6 x 6: GND 0,0
SOT23-6 = smd 0.55 x 1.2: 1 -0.95,-1.3; 2 0,-1.3; 3 0.95,-1.3; 4 0.95,1.3; 5 0,1.3; 6 -0.95,1.3
MKDSN1,5/3-5,08 = drill 1.3 pad 2: 1 -7.641,0.025; 2 -2.561,0.025; 3 2.519,0.025

### Placement (x,y rotation side)
C1  20.79,16.75 90 top
C2  38.92,14.91 180 top
C3  38.96,13.15 180 top
C4  66.28,1.56 180 bottom
C5  26.19,11.55 0 top
C6  10.74,20.78 270 top
C7  8.46,18.13 90 bottom
C8  24.49,11.92 180 bottom
C9  12.5,20.78 270 top
C10  21.89,22.02 270 top
C11  23.49,22.02 270 top
C12  25.1,22.02 270 top
C13  10.48,20.63 180 bottom
C14  4.32,9.57 270 bottom
C15  6.61,9.57 270 bottom
C16  52.14,14.59 270 top
C17  2.24,9.57 270 bottom
C18  24.84,22.89 0 bottom
C19  74,28 180 bottom
C20  58.1,5.8 180 top
C23  70.37,29.34 0 bottom
C24  72.86,28.49 90 top
C25  71.24,28.49 90 top
C28  2.4,22.62 90 bottom
D1  23.25,10.51 180 top
D2  23.3,4.46 0 top
D4  12.08,6.11 90 bottom
FB1  12.55,12.08 0 bottom
FB2  24.8,24.63 0 bottom
FB4  2.27,13.37 90 bottom
FID1  2,30 0 top
FID2  44,28.2 0 top
FID4  2,2 0 top
IC1  32.2,8.03 0 top
IC2  11.77,18.1 0 bottom
J1  63.24,1.57 180 top
J2  72.54,31.44 180 top
J3  40.82,4.71 90 top
J4  26.19,14.53 180 top
J5  19.34,7.72 270 top
J6  1.03,2.92 0 top
JTAG1  46.29,19.95 270 top
L2  16.34,25.6 90 top
LED1  61.66,28.44 180 top
Q2  9.56,23.92 270 bottom
Q3  29.59,17.23 90 top
R1  35.79,13.02 90 bottom
R2  31.86,9.05 180 bottom
R3  33.47,15 180 top
R4  33.47,12.79 180 top
R5  24.1,6.77 0 top
R6  24.1,8.36 0 top
R7  66.28,1.59 0 top
R8  9.62,15.2 0 bottom
R9  58.93,28.48 90 top
R10  53.17,25.66 0 top
R11  62.18,29.52 270 bottom
R12  54.12,14.52 270 top
R13  53.22,21.1 0 top
R14  64.23,28.12 270 bottom
R15  66.49,24.51 90 bottom
R16  19.03,15.65 90 top
R17  62.54,3.8 180 top
R18  68.53,24.51 90 bottom
R19  60.2,29.46 270 bottom
R20  34.77,17.56 270 top
R21  32.69,17.56 90 top
R22  10.73,24.01 270 top
R23  37.53,9.17 0 bottom
R24  53.23,23.37 0 top
R25  49.44,13.84 180 top
R26  71.56,21.88 90 bottom
R27  62.54,5.8 180 top
R28  16.04,15.18 270 top
R29  13.92,15.18 270 top
R30  11.79,15.18 270 top
R31  39.79,23.04 180 top
R32  66.64,3.69 180 top
R33  39.84,25.73 180 top
R34  49.44,13.67 0 bottom
R35  39.84,17.88 180 top
R36  39.79,20.42 180 top
R37  49.44,15.73 0 bottom
R38  67.5,27.43 0 bottom
R39  68.49,29.01 180 top
R40  35.17,3.58 180 top
R41  57.7,3.8 0 top
R42  27.75,5.49 270 top
R43  25.89,4.15 90 top
R44  35.19,1.52 180 top
R53  9.69,28.53 0 bottom
R54  9.72,26.63 180 bottom
R68  71.54,24.93 90 bottom
S1  51.16,19.18 0 bottom
S2  51.17,29.17 180 top
S3  51.17,24.23 0 bottom
T1  29.51,13.2 0 bottom
T2  32.82,13.25 0 bottom
TP1  10.75,26.4 270 top
TP2  23.58,25.16 270 top
TP19  40.8,1.27 270 top
TP20  43.15,1.25 270 top
U1  32.16,23.27 90 top
U2  67.09,16.67 0 top
U4  17.5,19.51 180 top
X2  4.97,23.1 90 top

### Tracks (layer width: path | path; a pad name or v marks a point on that pad's centre or on a via)
3.3V  (via drill 0.4, 0.4 pad 0.81)
  Top 0.254: IC1.6 IC1.7 29.51,6.34 R42.1
  Top 0.305: R39.1 69.78,28.57 v69.78,27.43 | J3.2 39.7,2.7 v40.8,2.7 | C2.1 39.8,13.1
  Top 0.406: IC1.7 29.06,5.89 v29.06,4.92 | C2.1 39.83,14.88 C3.1 | 39.8,13.1 39.8,12.19 v39.97,12.02 | v26.45,17.36 24.05,17.36 19.9,13.21 15.03,13.21 R29.2 R30.2 11.16,13.7 v10.6,13.7 | 70.93,27.93 C25.1 | v44.2,23.9 44.2,22.73 JTAG1.1 | v46.1,15.4 47.02,15.4 R25.2 | R7.2 67.33,1.59 69.4,3.66 v69.4,3.9
  Top 0.61: C12.1 25.12,22.88 25.82,22.88 26.45,22.26 v26.45,18.6 v26.45,17.36 | C24.1 C25.1
  Top 0.813: C24.1 73.52,26.95 U2.2 73.48,25.63 v73.48,24.23 | v69.78,27.43 69.97,27.61 C25.1
  Bottom 0.305: IC2.5 11.6,18.1 11.85,18.35 11.85,18.85 12.05,19.05 IC2.1 12.93,19.05 C13.2 | J2.1 72.54,29.4 | 72.54,29.4 72.54,28.64 71.25,27.35 71.17,27.43 v69.78,27.43 68.4,27.43 | 68.4,27.43 R38.1 | 68.4,27.43 68.4,25.49 R18.2 R15.2 64.58,27.27 R14.2 | C23.1 71.3,29.4 72.54,29.4 | R11.2 62.12,28.61 R19.2 | v40.8,2.7 37.64,5.86 37.64,6.26 | FB2.2 22.08,26.5 v22,26.5 | v29.06,4.92 30.04,5.9 34.5,5.9 35.4,6.8 37.1,6.8 37.64,6.26 | v39.97,12.02 38.38,10.43 R23.1 38.38,8.62 39,8 39,6.8 38.46,6.26 37.64,6.26
  Bottom 0.406: v39.97,12.02 39.97,20.23 39,21.2 39,22 40.9,23.9 v44.2,23.9 44.2,17.3 v46.1,15.4 46.1,14 47.6,12.5 55.1,12.5 57.8,9.8 64.3,9.8 64.9,10.4 70.2,10.4 72.3,8.3 72.3,7.2 69.4,4.3 v69.4,3.9 | v10.6,13.7 11,14.1 11.7,14.1 11.7,18.01 11.6,18.1
  Bottom 0.508: v39.97,12.02 39.97,13.53 35.55,17.95 27.04,17.95 v26.45,17.36
  Bottom 1.016: v26.45,18.6 v26.45,17.36
  other vias: 22,25.2 22,24 20.7,26.5
  pour Top (isolate 0.254): 21.47,22.57 25.51,22.57 25.51,24.12 20.22,28.79 12.44,28.79 12.44,25.68 21.47,25.68
  pour Bottom (isolate 0.3): 71.6,32.4 71.6,30.7 70.9,30 70.9,28.5 70.5,28.1 61.7,28.1 57,32.8 20.7,32.8 19.6,31.7 19.6,25.5 21.7,23.4 23.6,23.4 24.5,24.3 24.5,25.6 26.8,27.9 57.3,27.9 57.8,27.4 57.8,25.2 58.3,24.7 72.7,24.7 72.7,23.4 74,23.4 74,32.4
ACTIVE
  Top 0.305: R40.2 33.69,4.22 32.83,4.22 32.2,4.86 IC1.11
BTN1  (via drill 0.4)
  Top 0.305: U2.6 68.5,25.73 68.5,24.3 68.8,24 v70.1,24
  Bottom 0.305: R26.2 71.54,22.75 R68.1 71.53,24.1 70.2,24.1 v70.1,24
  Bottom 0.406: S1.1 56.88,21.6 65.8,21.6 66.4,21 69.7,21 71.43,22.73 R26.2
BTN2  (via drill 0.4)
  Top 0.305: v67.5,22.6 67.17,22.93 U2.7
  Top 0.406: S2.1 56.4,27.23 56.4,27.2 v56.5,27.1
  Bottom 0.305: R15.1 67.5,22.65 v67.5,22.6
  Bottom 0.406: v56.5,27.1 56.5,25.4 58.24,23.66 R15.1
BTN3  (via drill 0.4)
  Top 0.305: v70.1,22.7 70.98,23.58 U2.4
  Bottom 0.305: R18.1 69.49,22.7 v70.1,22.7
  Bottom 0.406: S3.1 56.11,22.6 66,22.6 67,21.6 69,21.6 v70.1,22.7
D_N_
  Top 0.305: J5.D- 23.24,8.37 R6.1 D1.3
D_N_CP
  Top 0.305: IC1.5 26.66,7.53 25.85,8.35 24.96,8.35 R6.2
D_P_
  Top 0.305: J5.D+ 21.39,7.72 22.36,6.76 R5.1 23.31,6.71 23.3,6.71 D2.3
D_P_CP  (via drill 0.4)
  Top 0.305: IC1.4 27.43,8.03 v26.8,8.66 | v26.16,6.76 24.96,6.76 R5.2
  Bottom 0.305: v26.8,8.66 26.48,8.35 26.48,7.08 v26.16,6.76
DTR  (via drill 0.4)
  Top 0.305: v31,15 31,14.9 28.65,12.55 v28.65,10.3 28.88,10.53 IC1.28
  Bottom 0.203: v28.65,10.3 28.65,12.01 T1.2
  Bottom 0.305: R1.2 35.79,15.27 34.86,16.2 32.2,16.2 v31,15
FAN
  Top 0.61: Q3.1 31.39,16.28 31.81,16.71 R21.1 R20.2
FAN_MCU  (via drill 0.4)
  Top 0.305: U2.37 73.5,7.69 v73.5,9.2 | v51.8,4.6 51,4.6 40.9,14.7 40.9,16 40.6,16.3 37.9,16.3 35.79,18.41 R20.1
  Bottom 0.305: v73.5,9.2 73.5,6.8 69.6,2.9 67.07,2.9 65.51,4.46 56.3,4.46 55.04,3.2 53.2,3.2 v51.8,4.6
GND  (via drill 0.4, 0.4 pad 0.81, 2)
  Top 0.305: IC1.EXP 31.7,8.53 IC1.3 28.87,8.53 v27.07,10.34 v27.06,10.34 C5.2 | C24.2 C25.2 71.24,30.2 J2.2 | D2.2 23.93,3.56 v23.93,4.47 | J3.4 37.49,4.71 36.6,5.6 36.6,5.8 v36.84,5.8
  Top 0.406: J5.GND 19.34,5.17 J5.P2 | R40.1 36.02,1.69 R44.1 35.99,1.64 | C3.2 38.08,14.88 C2.2 | 67.03,16.73 U2.GND
  Top 0.61: C6.2 C9.2 12.93,19.9 13.38,19.46 18.04,19.46 18.36,19.77 18.67,19.77 18.67,20.6 U4.1
  Top 0.813: U2.1 74.79,28.71 74.2,29.3 72.92,29.3 C24.2 | U2.15 61.38,22.39 v67.1,16.66
  Top 1.016: 69.03,19.79 63.99,19.79 63.99,13.55 70.23,13.55 70.23,18.4 | v72.6,18.4 70.23,18.4 | 70.23,18.4 70.23,18.72
  Bottom 0.305: J2.2 69.49,30.94 C23.2 | J1.2 59.27,3 57.5,3 56.2,1.7 v56.2,1.1
  Bottom 0.406: 17.52,7.72 17.52,4.73 19.59,4.73 J5.P2 20.05,4.47 v23.93,4.47 | 17.52,7.72 J5.P3 | 17.52,7.72 17.52,10.32 19.39,10.32 J5.P1 | C4.2 68.66,1.56 v68.7,1.6
  other vias: 20.46,23.95 20.46,22.39 20.46,19.28 19.46,20.4 23.59,19.63 50.2,19 51.8,17.9 42.6,26.5 46.4,26.5 42.6,20.6 48.3,10.1 50.6,8.1 41.9,11.8 8.2,20.4 8.2,21.8 7.1,13.6 3.5,18 14,20.3 17.8,15 47.5,4.7 47.5,2.3 67.6,9.4 58.6,18.4 58.6,16.4 58.6,14.4 58.6,12.4 60.6,12.4 62.6,12.4 64.6,12.4 66.6,12.4 68.6,12.4 70.6,12.4 72.6,12.4 74.6,12.4 74.6,14.4 74.6,16.4 74.6,18.4 74.6,20.4 74.6,22.4 72.6,16.4 61.6,18.4 61.6,16.4 61.6,14.4 75.1,6 69.9,0.9 74.9,29.4 58.8,32.1 50.9,26.4 48.8,26.4 27.2,26.9 18.2,32.1 15.2,32.1 12.2,32.1 9.2,32.1 6.2,32.1 3.2,32.1 1.2,28.1 1.2,25.1 1.2,22.1 1.2,19.1 1.2,16.1 1.2,7.1 1.2,5.1 4.2,1.1 7.2,1.1 10.2,1.1 13.2,1.1 16.2,1.1 19.2,1.1 22.2,1.1 26.2,1.1 50.2,1.1 53.2,1.1 38.2,1.1 30.2,26.1 34.2,26.1 31,19.9 43.6,9.3
  pour Top (isolate 0.254): 18.36,21.95 18.36,19.95 10.37,19.95 10.37,18.99 25.57,18.99 25.57,21.32 20.84,21.32 20.84,24.44 19.91,24.44 19.91,21.95
  pour Top (isolate 0.3, rank 2): -4,38 -4,-2 80,-2 80,38
  pour Bottom (isolate 0.3, rank 2): -6,40 82,40 82,-4 -6,-4
GPIO0  (via drill 0.4)
  Top 0.305: 38.89,6.05 37.8,7.14 v37.8,7.6 | J3.6 v39.89,6.9 v39.9,6.9 | v56.6,7.6 56.67,7.67 U2.25
  Top 0.406: J3.6 38.89,6.05
  Bottom 0.305: v37.8,7.6 37.55,7.6 36.68,8.47 R23.2 36.68,9.47 37.78,10.57 37.78,14.51 35.4,16.89 30.49,16.89 29.51,15.91 T1.3 | v39.9,6.9 40,7 56,7 v56.6,7.6
IR_REC
  Top 0.305: U2.27 60.7,7.55 60.7,6.5 60.2,6 59.17,6 C20.1 58.55,5.38 R41.2
L_B
  Top 0.254: U2.12 60.82,27.16 LED1.1
L_G
  Top 0.254: LED1.2 62.11,25.69 62.1,25.68
  Top 0.305: 62.1,25.68 U2.11
L_R
  Top 0.254: U2.10 63.36,27.19 LED1.3
LED_DRIVE_5V  (via drill 0.4)
  Top 0.305: v7.5,15.2 7.5,18.85 5.82,20.54 X2.2
  Bottom 0.305: R8.2 v7.5,15.2
LED_WS  (via drill 0.4)
  Top 0.305: R27.2 R17.2 60.6,3.8 v60.5,3.7
  Top 0.406: v16.5,11.85 16.5,9.3 16.1,8.9 16.1,4.3 v17.1,3.3 | R32.2 64.61,3.69 v64.6,3.7
  Bottom 0.406: IC2.3 13.07,15.87 13.05,15.85 13.05,15.35 16.5,11.9 v16.5,11.85 | v17.1,3.3 26,3.3 28,1.3 33,1.3 34.7,3 39.3,3 41,1.3 48,1.3 48.9,2.2 55.1,2.2 56.6,3.7 v60.5,3.7 v64.6,3.7
MIC_DATA
  Top 0.305: R33.2 37.7,27.03 37.7,27.2 29.74,27.2 U1.SD
MIC_LR
  Top 0.305: U1.LR 36.27,20.42 R36.2 38.94,17.93 R35.2
MIC_SCK
  Bottom 0.305: U1.SCK 36.48,25.3 41.59,25.3 45.51,25.3 45.91,24.91 | 45.9,24.9 45.9,19.9 45.9,17.6 47.77,15.73 R37.2 R34.2
  Bottom 0.406: 45.9,24.9 45.91,24.91
MIC_WS
  Top 0.305: R31.2 36.19,23.04 U1.WS
MTCK
  Top 0.406: U2.16 54.08,21.12 R13.2
MTDI
  Top 0.305: U2.14 58.28,26.98 R9.1
  Top 0.406: U2.14 R10.2
MTDO
  Top 0.305: R12.2 54.14,13.65 55.1,13.65 55.39,13.36 55.39,12.6 55.76,12.23 U2.23
MTMS  (via drill 0.4)
  Top 0.305: v54.8,22.3 54.08,23.02 R24.2
  Top 0.406: U2.13 59.55,24.36 59.39,24.2 54.9,24.2 R24.2
  Bottom 0.305: R37.1 50.29,17.79 v54.8,22.3
N$1
  Bottom 0.203: T2.1 35.77,12.15 R1.1
N$2
  Bottom 0.203: R2.1 31.01,9.99 30.45,10.55 T1.1
N$3
  Top 0.406: C1.1 20.65,15.87 19.58,14.8 R16.1
N$4
  Bottom 0.305: R54.1 8.56,26.33 Q2.3 | C28.1 2.28,21.62 2.27,21.62
  Bottom 0.61: C28.1 2.56,21.9 3.2,21.9 4.25,22.95 7.6,22.95 Q2.3
  Bottom 0.813: 2.27,21.62 FB4.2
N$5
  Top 0.305: J1.3 56.85,2.88 R41.1
N$6  (via drill 0.4)
  Top 0.305: v60.2,32.1 60.2,30.33 LED1.6
  Bottom 0.305: R19.1 v60.2,32.1 | v60.2,32.1
N$8
  Top 0.61: J4.1 28.49,16.83 Q3.3
N$9
  Top 0.305: J1.1 C4.1
  Top 0.406: C4.1 R7.1
  Bottom 0.305: C4.1 63.25,1.56 J1.1
N$10
  Bottom 0.305: IC2.4 R8.1
N$11  (via drill 0.4)
  Top 0.305: v61.5,32 62.11,31.39 LED1.5
  Bottom 0.305: R11.1 62.18,31.32 v61.5,32
N$12
  Bottom 0.305: FB2.1 25.72,24.56 C18.1 26.1,23.27 U1.VDD
N$13
  Top 0.305: R27.1 62.09,7.1 U2.28
N$14
  Top 0.305: R32.1 67.49,5.79 68.44,6.74 U2.33
N$15
  Top 0.406: R16.2 19.03,17.63 U4.6
N$16  (via drill 0.4)
  Top 0.305: v62.97,32 62.97,29.29 LED1.4
  Bottom 0.305: R14.1 63.4,29.8 63.4,31.57 v62.97,32
N$17  (via drill 0.4)
  Top 0.305: v54.7,4.5 54.7,7.7 51.3,11.1 46.8,11.1 v42,15.9 | v41.8,23 41.8,25.6 41.67,25.73 R33.1 | v68.42,4.67 70.17,4.67 72.25,6.75 U2.36
  Bottom 0.305: v54.7,4.5 55.2,5 68.09,5 v68.42,4.67 | v41.8,23 41.8,16.1 v42,15.9
N$19  (via drill 0.4 pad 0.81)
  Top 0.406: v22.09,17.61 22.07,17.62 C1.2 | 17.47,23.2 17.27,23.4 L2.P$1
  Top 0.61: 17.47,23.2 17.47,22.33 17.5,22.3 U4.2 17.5,21.98 v17.47,22.01
  Bottom 0.305: v22.09,17.61 22.09,19.15 19.23,22.01 v17.47,22.01
N$20
  Top 0.305: U2.26 59.55,8.75 58.8,9.5 54.5,9.5 52,12 47.4,12 41.52,17.88 R35.1
N$23  (via drill 0.4 pad 0.81)
  Top 0.305: TP1.TP 10.75,24.94 R22.1 11.05,24.89 v12.44,23.5 | v17.52,16.28 17.42,18.14 U4.5
  Bottom 0.305: v12.44,23.5 14.95,23.5 16.35,22.1 16.35,17.4 17.47,16.28 v17.52,16.28
N$24
  Top 0.406: U4.4 16.55,17.34 16.18,16.97 16.18,16.17 R28.1 R29.1 R30.1
N$38  (via drill 0.4 pad 0.81)
  Top 0.305: IC1.9 31.2,4.9 31.21,4.89 31.21,4.42 32.22,3.41 v32.22,3.16 | v29.34,2.66 28.92,2.66 28.41,3.17 28.41,3.98 R42.2
  Bottom 0.305: v32.22,3.16 29.84,3.16 v29.34,2.66
N$39
  Top 0.305: IC1.8 30.59,5.42 30.59,3.17 31.52,2.24 | 31.52,2.24 32.24,1.52 R44.2 | R43.1 27.88,1.3 30.59,1.3 31.52,2.24
NRST  (via drill 0.4, 0.4 pad 0.81)
  Top 0.305: R25.1 50.28,16.43 50.59,16.73 v52.79,16.73 52.14,16.73 C16.1 52.84,15.46 53.1,15.2 53.1,12.5 v54.1,11.5 | v50.8,10.1 53.2,7.7 53.2,4.5 52.2,3.5 42.73,3.5 J3.1 42.4,3.17 42.4,2.3 41.37,1.27 TP19.TP 40.03,1.27 38.9,2.4 37.5,2.4 37.1,2.8 37.1,4.25 35.88,5.47 v35.88,7.57 | v70.46,20.41 70.89,20.41
  Top 0.406: 70.89,20.41 72.25,21.77 U2.3 | JTAG1.10 49.68,17.41 50.37,16.73 v52.79,16.73
  Bottom 0.305: v50.8,10.1 52.2,11.5 v54.1,11.5 | T2.3 33.55,14.35 34.9,13 36.7,13 36.9,12.8 36.9,11.2 35.6,9.9 35.6,7.85 v35.88,7.57 | v70.46,20.41 70.56,20.3 70.82,20.3
  Bottom 0.406: v52.79,16.73 55.1,16.73 56.6,18.23 56.6,19.8 57.1,20.3 70.82,20.3 R26.1
RTS  (via drill 0.4 pad 0.81)
  Top 0.305: v35.26,10.64 34.33,11.57 32.77,11.57 32.7,11.5 IC1.24
  Bottom 0.203: v35.26,10.64 32.7,10.64 | 32.7,10.64 32.36,10.64 31.87,11.13 T2.2 | R2.2 32.71,10.63 32.7,10.64
RXD0  (via drill 0.4)
  Top 0.305: U2.34 v69.71,9.09 v69.7,9.1 | v44.9,6.1 44.77,5.97 J3.5
  Top 0.406: J3.5 42.83,5.82 42.83,6.5 R3.1
  Bottom 0.305: v69.7,9.1 69.7,9.02 66.88,6.2 45,6.2 v44.9,6.1
RXD0_CP2101IN
  Top 0.305: R3.2 31.7,14.08 IC1.26
SCL
  Top 0.305: J2.3 67.46,29.19 R39.2 65.9,27.26 U2.8
SDA
  Top 0.305: U2.9 64.93,25.97 J2.4
  Bottom 0.305: J2.4 66.65,29.71 R38.2
TCKCONN
  Top 0.406: R13.1 48.26,21.1 JTAG1.4
TDICONN
  Top 0.305: JTAG1.8 46.72,18.68 46.3,19.1 46.3,23.3 46.7,23.7 50.35,23.7 52.09,25.44
  Top 0.406: 52.09,25.44 R10.1
TDOCONN
  Top 0.406: R12.1 54.1,15.21 54.1,17.41 51.55,19.95 JTAG1.6
TMSCONN
  Top 0.406: JTAG1.2 48.34,22.29 51.3,22.29 R24.1
TXD0  (via drill 0.4)
  Top 0.305: U2.35 70.9,7.59 70.9,6.9 70.2,6.2 69.45,6.2 v69.42,6.17 | v45,4.8 44.91,4.71 J3.3
  Top 0.406: R4.1 35.32,12.79 40,8.1 40.85,7.25 40.85,4.9 41.05,4.71 J3.3
  Bottom 0.305: v69.42,6.17 68.85,5.6 45.8,5.6 v45,4.8
TXD0_CP2101
  Top 0.305: R4.2 32.52,12.37 32.52,12.47 32.2,12.15 IC1.25
V_USB  (via drill 0.4 pad 0.81)
  Top 0.305: J5.VBUS 20.57,9.02 v21.26,9.71 | v25.3,10.33 25.31,10.34 C5.1 25.25,11.48 23.94,11.48 | v21.26,5.35 22.65,3.95 D2.1 23.44,2.75 24.25,2.75 24.85,3.35 24.85,4.65 25.15,4.95 25.84,4.95 R43.2
  Top 0.406: D1.1 23.94,11.48
  Bottom 0.305: v21.26,5.35 v21.26,9.71 24.68,9.71 v25.3,10.33
  Bottom 0.406: v21.26,9.71 21.26,11.54 20.72,12.08 17.66,12.08 17.66,11.71 16.93,10.99 15.91,10.99 15.34,11.56 15.34,12.08 FB1.1
VGI
  Bottom 0.305: Q2.1 R54.2 10.57,28.51 R53.1
VIN
  Bottom 0.305: X2.1 7.05,17.56 7.05,18.25 7.8,19 C7.2 8.51,19.05 IC2.6
  Bottom 0.61: D4.3 14.4,6.11 J6.P4B
  Bottom 0.813: FB4.1 2.27,10.48 C17.1
  Bottom 1.016: J6.P4B J6.P4A 12.38,9.47 11.7,10.15 FB1.2 6.55,12.08 | 6.55,12.08 6.02,12.08 4.95,13.15 X2.1 | C17.1 C14.1 C15.1 6.61,12.03 6.55,12.08
VIN_PROTECTED  (via drill 0.4)
  Top 0.61: R22.2 10.7,21.68 C6.1 C9.1 12.52,21.64 v15.2,21.64 15.87,21.64 16.55,20.95 U4.3
  Bottom 0.508: 23.07,13.95 J4.2 23.61,14.49 C8.1
  Bottom 0.61: 23.07,13.95 17.5,13.95 15.2,16.25 v15.2,21.64
  Bottom 0.813: Q2.2 11.53,22 14.84,22 v15.2,21.64 14.15,21.64 v14.1,21.59
VSPI_MISO  (via drill 0.4)
  Top 0.305: U2.31 v65.9,9.4 | v40.7,21.7 40.64,21.76 R31.1
  Bottom 0.305: v65.9,9.4 65.5,9 47.3,9 40.7,15.6 v40.7,21.7
VSPI_MOSI
  Top 0.305: R17.1 63.59,3.8 64.63,4.83 U2.30
VSPI_SCK  (via drill 0.4)
  Top 0.305: v63.3,10.7 63.36,10.64 U2.29
  Bottom 0.305: v63.3,10.7 63.2,10.6 58.74,10.6 55.67,13.67 R34.1

### Text on the board
tPlace: 1 | 14 | 25 | 38
tDocu: IO35 | BrimEffect v1 | SDA | SCL | 3V3 | FAN | Drain | 5V | UART
bDocu: 3V3 | GND | SD | Electronics design / solutions s.r.o. | SCK | IO36 | LED / IO25-R / IO26-G / IO27-B | LED | VDD | WS | DATA | GND | LR | NRST/IO34 | NRST | 5V | BrimEffect v1 | use USB 5V | J.Repcik / 04/2020 | GND | IR | VDD